# Altium schematic sheet MCU.SchDoc
size A4; SheetNumber: 4; SheetTotal: 4
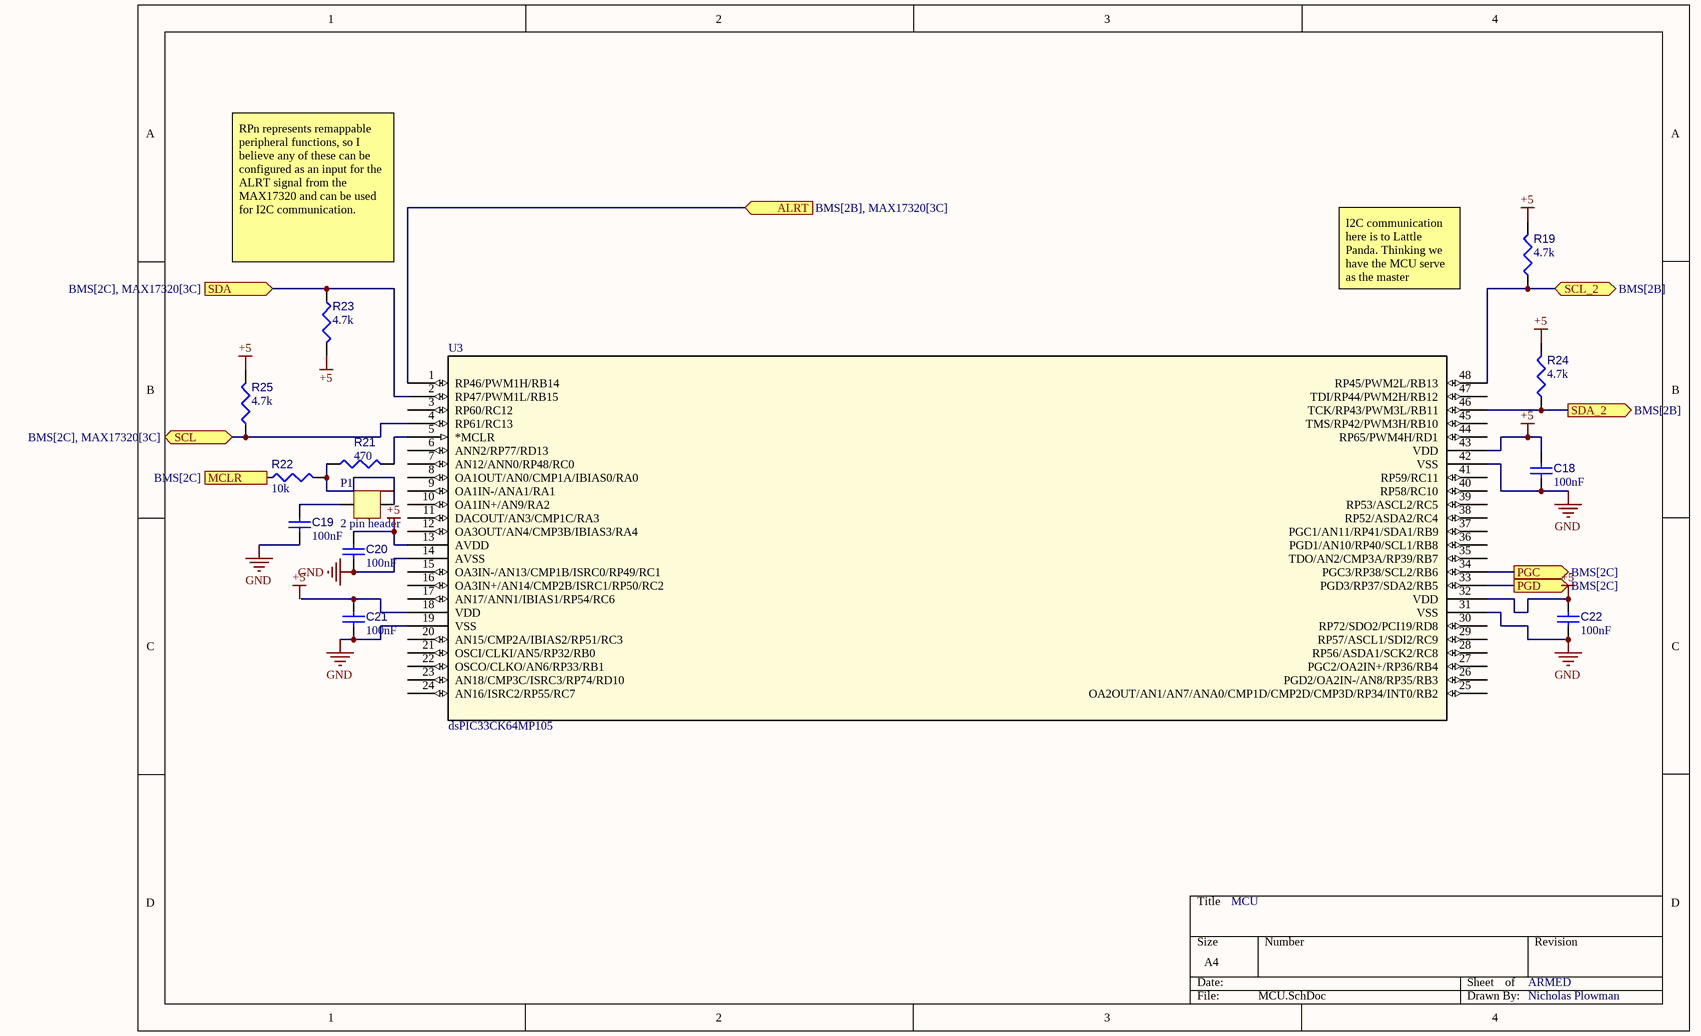
[diagram p0: MCU.SchDoc]

## Parts
C18  value 100nF  [CAPC1005X56X25LL10T15]  (hidden comment: Capacitor 0.1 uF +/- 5% 16 V 0402)
C19  value 100nF  [CAPC1005X56X25LL10T15]  (hidden comment: Capacitor 0.1 uF +/- 5% 16 V 0402)
C20  value 100nF  [CAPC1005X56X25LL10T15]  (hidden comment: Capacitor 0.1 uF +/- 5% 16 V 0402)
C21  value 100nF  [CAPC1005X56X25LL10T15]  (hidden comment: Capacitor 0.1 uF +/- 5% 16 V 0402)
C22  value 100nF  [CAPC1005X56X25LL10T15]  (hidden comment: Capacitor 0.1 uF +/- 5% 16 V 0402)
P1  2 pin header  [2 pin header-Footprint-1]
R19  value 4.7k  [RESC3116X70X50ML13T20]  (hidden comment: Resistor 4k7 +/-1% 1206 250 mW)
R21  value 470  [RESC0805(2012)_L]  (hidden comment: Resistor 470R +/-5% 0805 125 mW)
R22  value 10k  [RESC3216X60X45ML15T20]  (hidden comment: Resistor 10k +/-1% 1206 250 mW)
R23  value 4.7k  [RESC3116X70X50ML13T20]  (hidden comment: Resistor 4k7 +/-1% 1206 250 mW)
R24  value 4.7k  [RESC3116X70X50ML13T20]  (hidden comment: Resistor 4k7 +/-1% 1206 250 mW)
R25  value 4.7k  [RESC3116X70X50ML13T20]  (hidden comment: Resistor 4k7 +/-1% 1206 250 mW)
U3  dsPIC33CK64MP105  [dsPIC33CK64MP105-Footprint-1]

## Ports
ALRT (in, see BMS[2B], MAX17320[3C]), MCLR (in, see BMS[2C]), PGC (out, see BMS[2C]), PGD (out, see BMS[2C]), SCL (bidir, see BMS[2C], MAX17320[3C]), SCL_2 (bidir, see BMS[2B]), SDA (in, see BMS[2C], MAX17320[3C]), SDA_2 (out, see BMS[2B])

## Nets
+5: C18.1 C20.2 C22.1 R19.2 R23.2 R24.2 R25.2 U3.13(AVDD) U3.32(VDD) U3.43(VDD)
GND: C18.2 C19.1 C20.1 C21.1 C22.2 U3.14(AVSS) U3.19(VSS) U3.31(VSS) U3.42(VSS)
ALRT: U3.1(RP46/PWM1H/RB14) ; port ALRT
PGC: U3.34(PGC3/RP38/SCL2/RB6) ; port PGC
PGD: U3.33(PGD3/RP37/SDA2/RB5) ; port PGD
SCL: R25.1 U3.4(RP61/RC13) ; port SCL
SCL_2: R19.1 U3.48(RP45/PWM2L/RB13) ; port SCL_2
SDA: R23.1 U3.2(RP47/PWM1L/RB15) ; port SDA
SDA_2: R24.1 U3.46(TCK/RP43/PWM3L/RB11) ; port SDA_2
NetC19_2: C19.2 P1.1
NetC21_2: C21.2 U3.18(VDD)
NetP1_2: P1.2 R21.1 R22.2
NetR21_2: R21.2 U3.5(*MCLR)

Not connected (* = marked no-connect by the designer): R22 1; U3 3(RP60/RC12) 6(ANN2/RP77/RD13) 7(AN12/ANN0/RP48/RC0) 8(OA1OUT/AN0/CMP1A/IBIAS0/RA0) 9(OA1IN-/ANA1/RA1) 10(OA1IN+/AN9/RA2) 11(DACOUT/AN3/CMP1C/RA3) 12(OA3OUT/AN4/CMP3B/IBIAS3/RA4) 15(OA3IN-/AN13/CMP1B/ISRC0/RP49/RC1) 16(OA3IN+/AN14/CMP2B/ISRC1/RP50/RC2) 17(AN17/ANN1/IBIAS1/RP54/RC6) 20(AN15/CMP2A/IBIAS2/RP51/RC3) 21(OSCI/CLKI/AN5/RP32/RB0) 22(OSCO/CLKO/AN6/RP33/RB1) 23(AN18/CMP3C/ISRC3/RP74/RD10) 24(AN16/ISRC2/RP55/RC7) 25(OA2OUT/AN1/AN7/ANA0/CMP1D/CMP2D/CMP3D/RP34/INT0/RB2) 26(PGD2/OA2IN-/AN8/RP35/RB3) 27(PGC2/OA2IN+/RP36/RB4) 28(RP56/ASDA1/SCK2/RC8) 29(RP57/ASCL1/SDI2/RC9) 30(RP72/SDO2/PCI19/RD8) 35(TDO/AN2/CMP3A/RP39/RB7) 36(PGD1/AN10/RP40/SCL1/RB8) 37(PGC1/AN11/RP41/SDA1/RB9) 38(RP52/ASDA2/RC4) 39(RP53/ASCL2/RC5) 40(RP58/RC10) 41(RP59/RC11) 44(RP65/PWM4H/RD1) 45(TMS/RP42/PWM3H/RB10) 47(TDI/RP44/PWM2H/RB12)

## Notes on the sheet
- (near R23) RPn represents remappable peripheral functions, so I believe any of these can be configured as an input for the ALRT signal from the MAX17320 and can be used for I2C communication.
- I2C communication here is to Lattle Panda. Thinking we have the MCU serve as the master
- MCU
- ARMED
- Nicholas Plowman
- Labels drawn without touching a wire or pin: +5

## Library data of the parts
C18-C22 = CMP-001-00001-6: Chip Capacitor, 0.1 uF, +/- 5%, 16 V, 0402 (1005 Metric); Capacitor Type: Ceramic; Voltage Rating: 16V; Max Operating Temperature: 125°C; Min Operating Temperature: -55°C; Case/Package: 0402; Mounting Technology: SM; Pins: 2; Tolerance: 5%; RoHS Compliant: True
P1 = CMP-00014-2
R19 R23-R25 = CMP-009-00033-5: Chip Resistor, 4.7 KOhm, +/- 1%, 0.25 W, -55 to 155 degC, 1206 (3216 Metric); Power: 250mW; Voltage Rating: 200V; Pins: 2; Min Operating Temperature: -55°C; Max Operating Temperature: 155°C; Case/Package: 1206; Tolerance: 1%; RoHS Compliant: True; Mounting Technology: SM
R21 = CMP-009-00122-3: Chip Resistor, 470 Ohms, +/-5%, 125 mW, -55 to 155 degC, 0805; Tolerance: 5%; Power: 125mW; Max Operating Temperature: 155°C; Case/Package: 0805; Pins: 2; Min Operating Temperature: -55°C
R22 = CMP-009-00016-5: Chip Resistor, 10 KOhm, +/- 1%, 0.25 W, -55 to 155 degC, 1206 (3216 Metric); Power: 250mW; Voltage Rating: 200V; Pins: 2; Max Operating Temperature: 155°C; Tolerance: 1%; RoHS Compliant: True; Case/Package: 1206; Min Operating Temperature: -55°C; Mounting Technology: SM
U3 = CMP-001-0001-1: 16-bit MCU/DSC, 64 KB, 8192 Bytes, 100 MHz, 3 to 3.6V, TQFP-48, RoHS